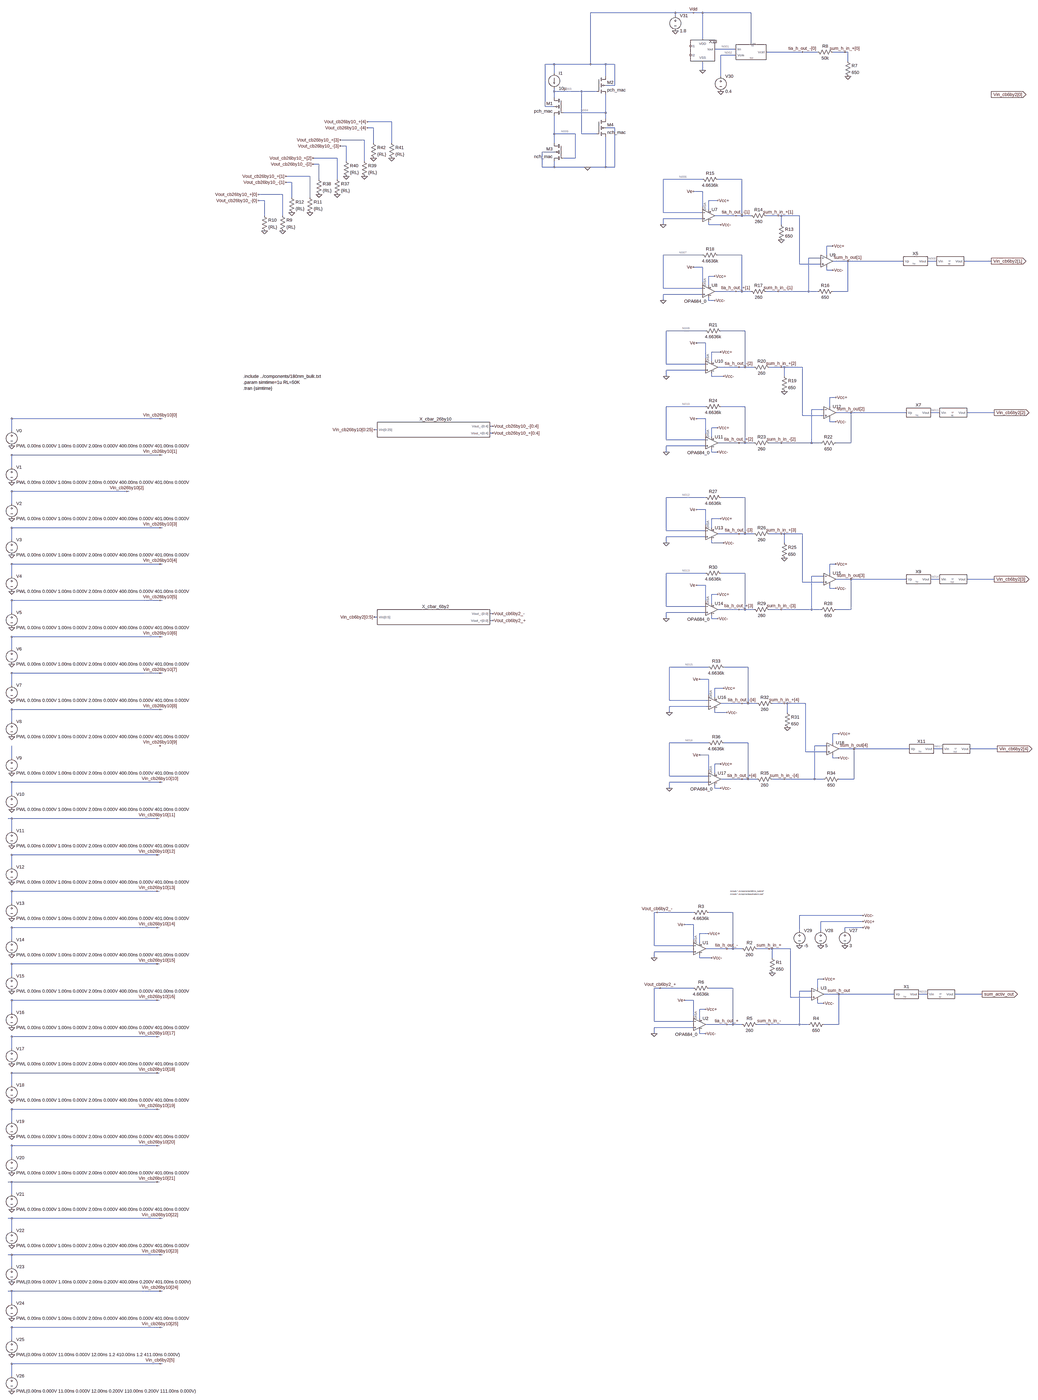
[diagram p0: schematic complete_circuit_generated_2.asc, whole sheet]
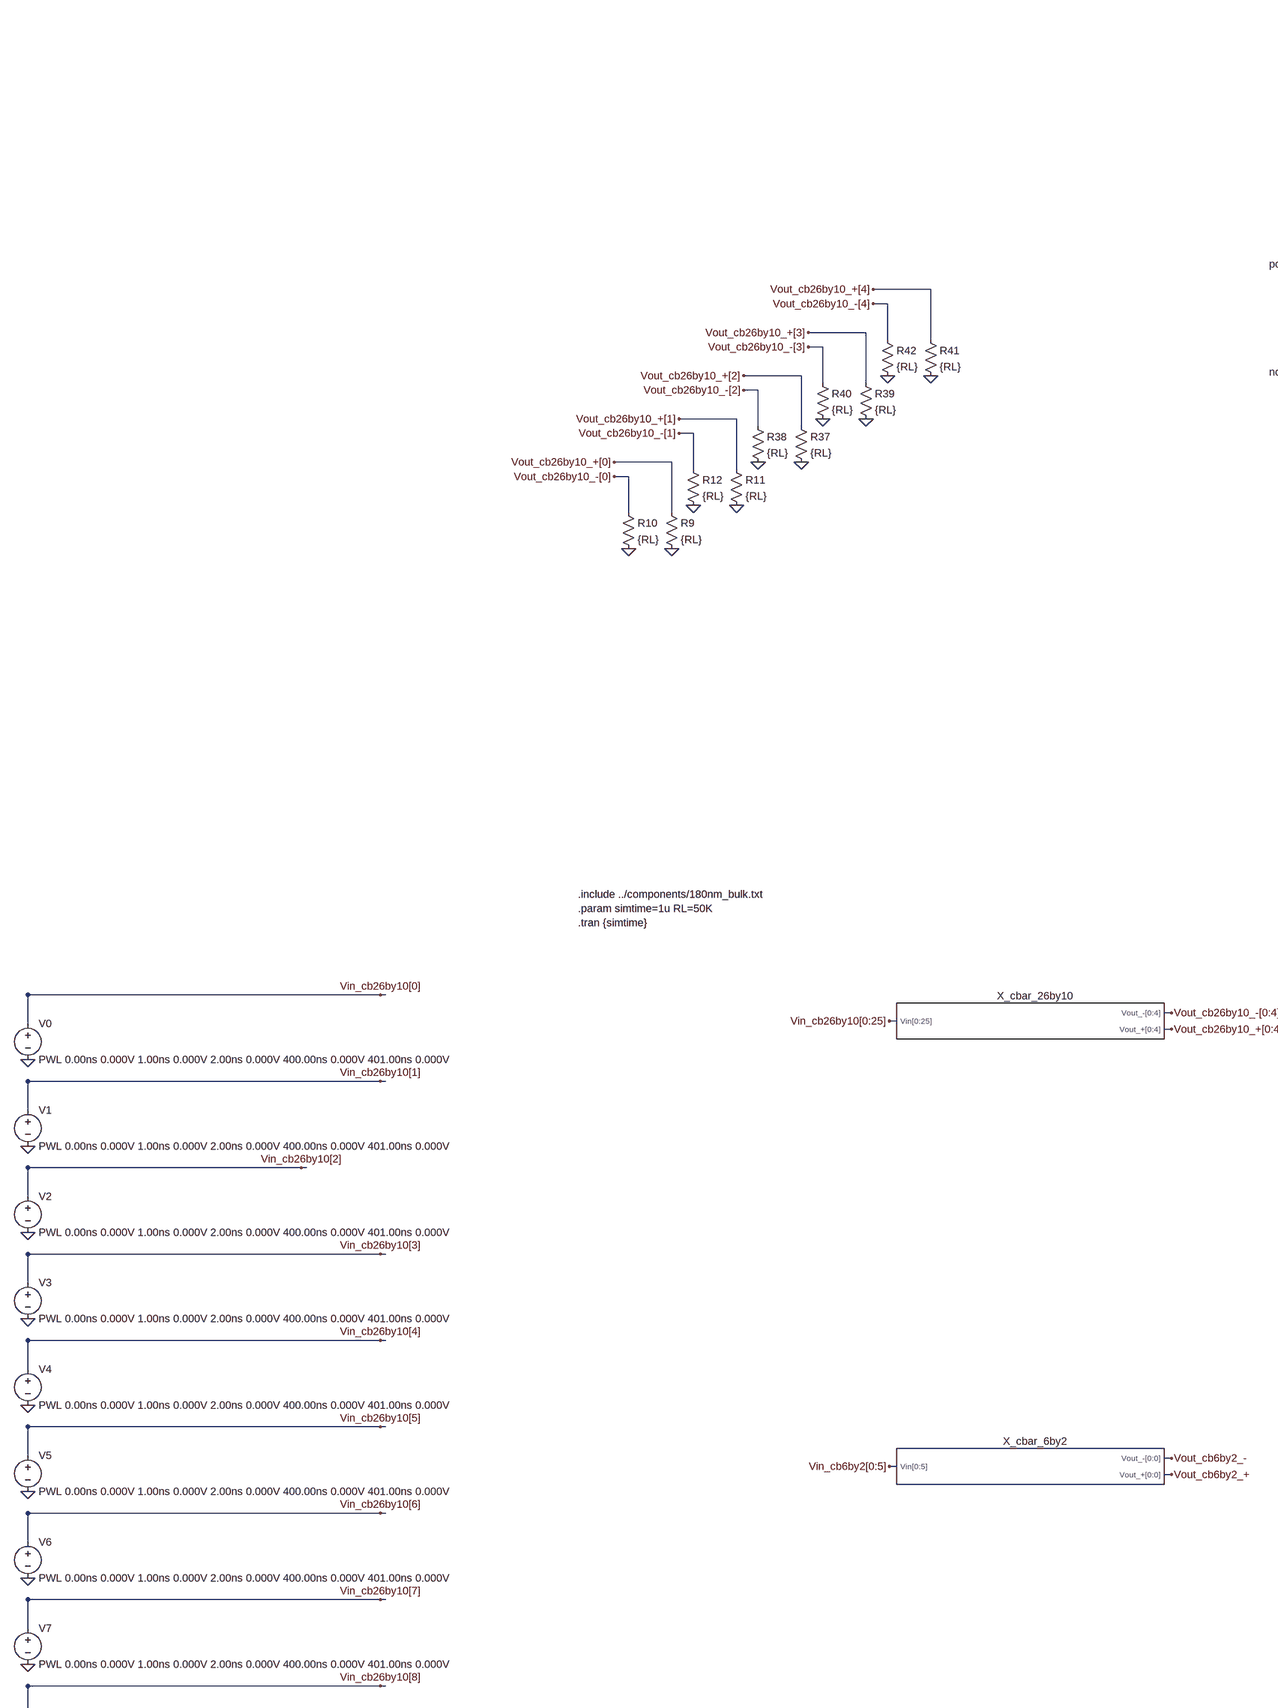
[diagram p1: schematic complete_circuit_generated_2.asc, part, row 1 of 2, column 1 of 2]
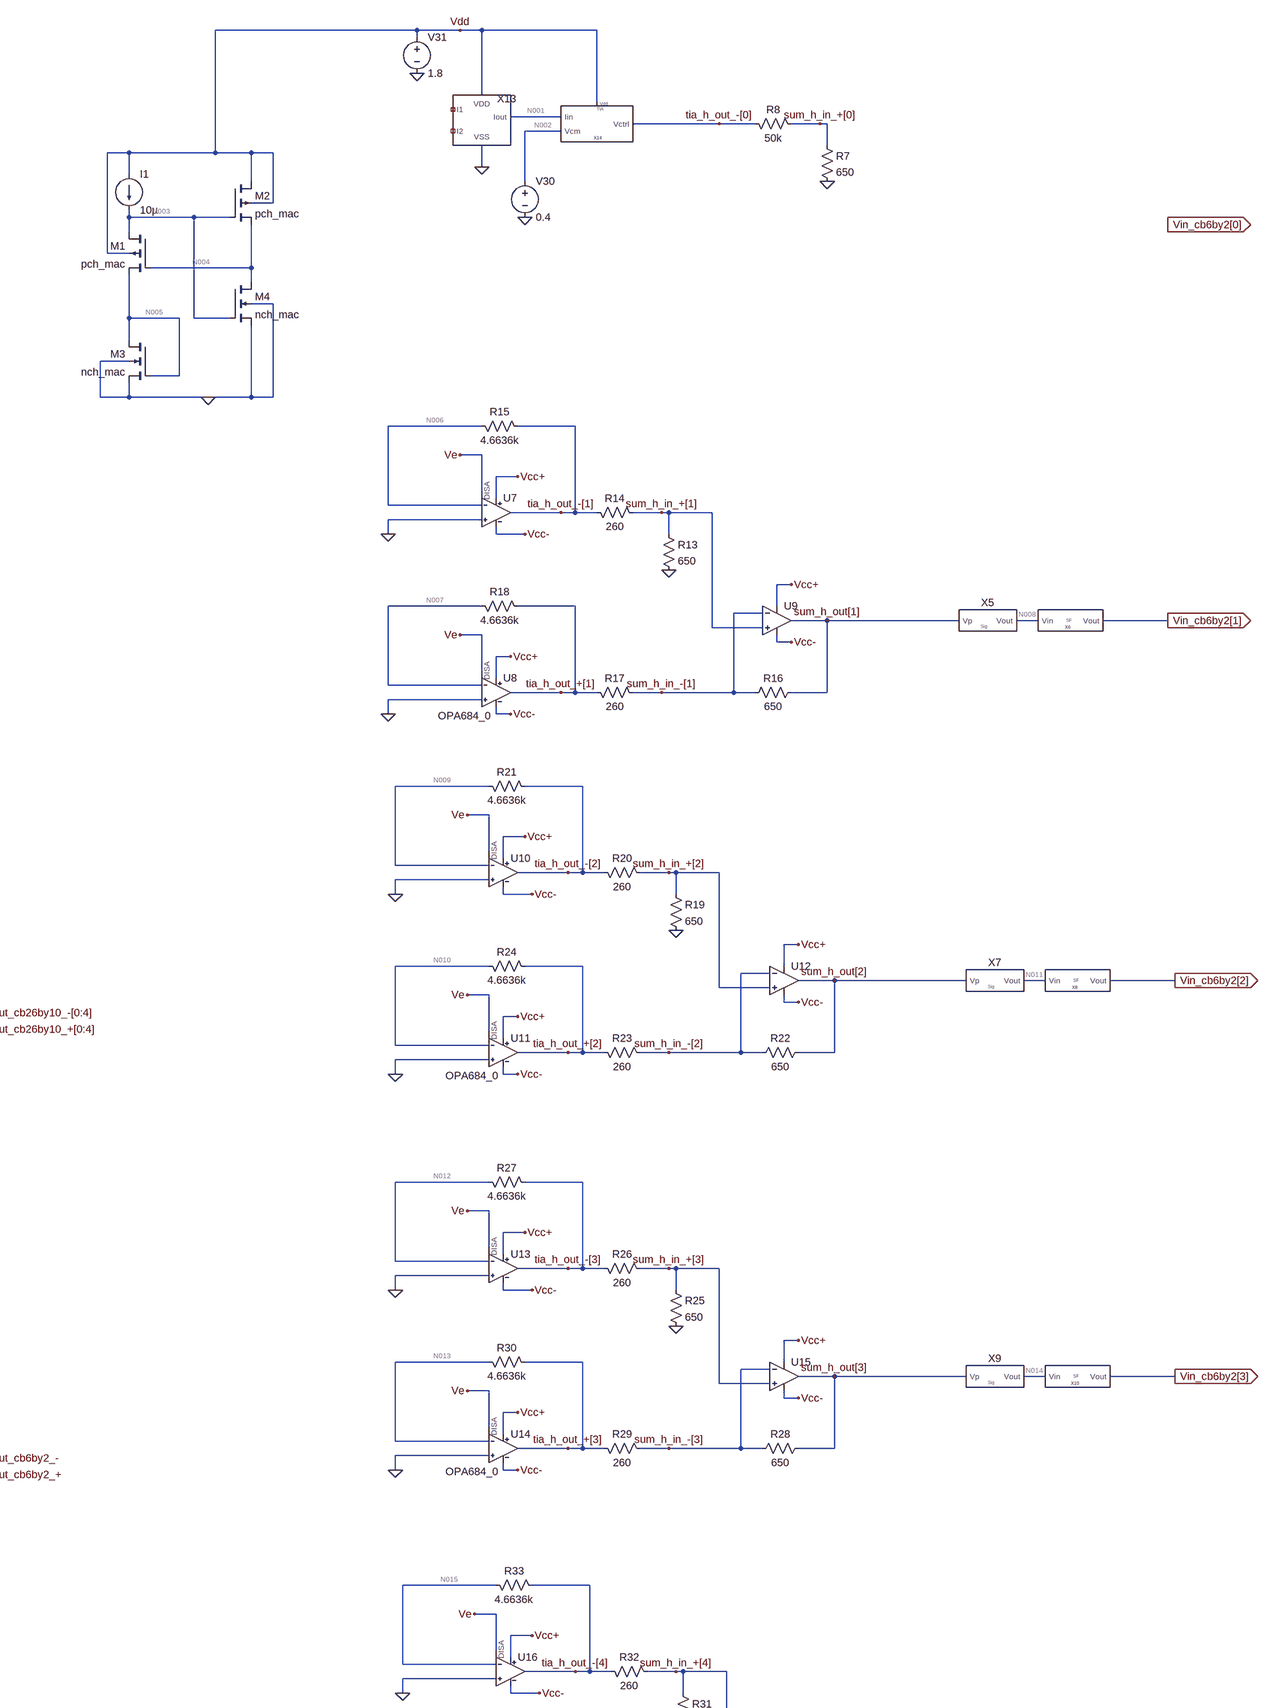
[diagram p2: schematic complete_circuit_generated_2.asc, part, row 1 of 2, column 2 of 2]
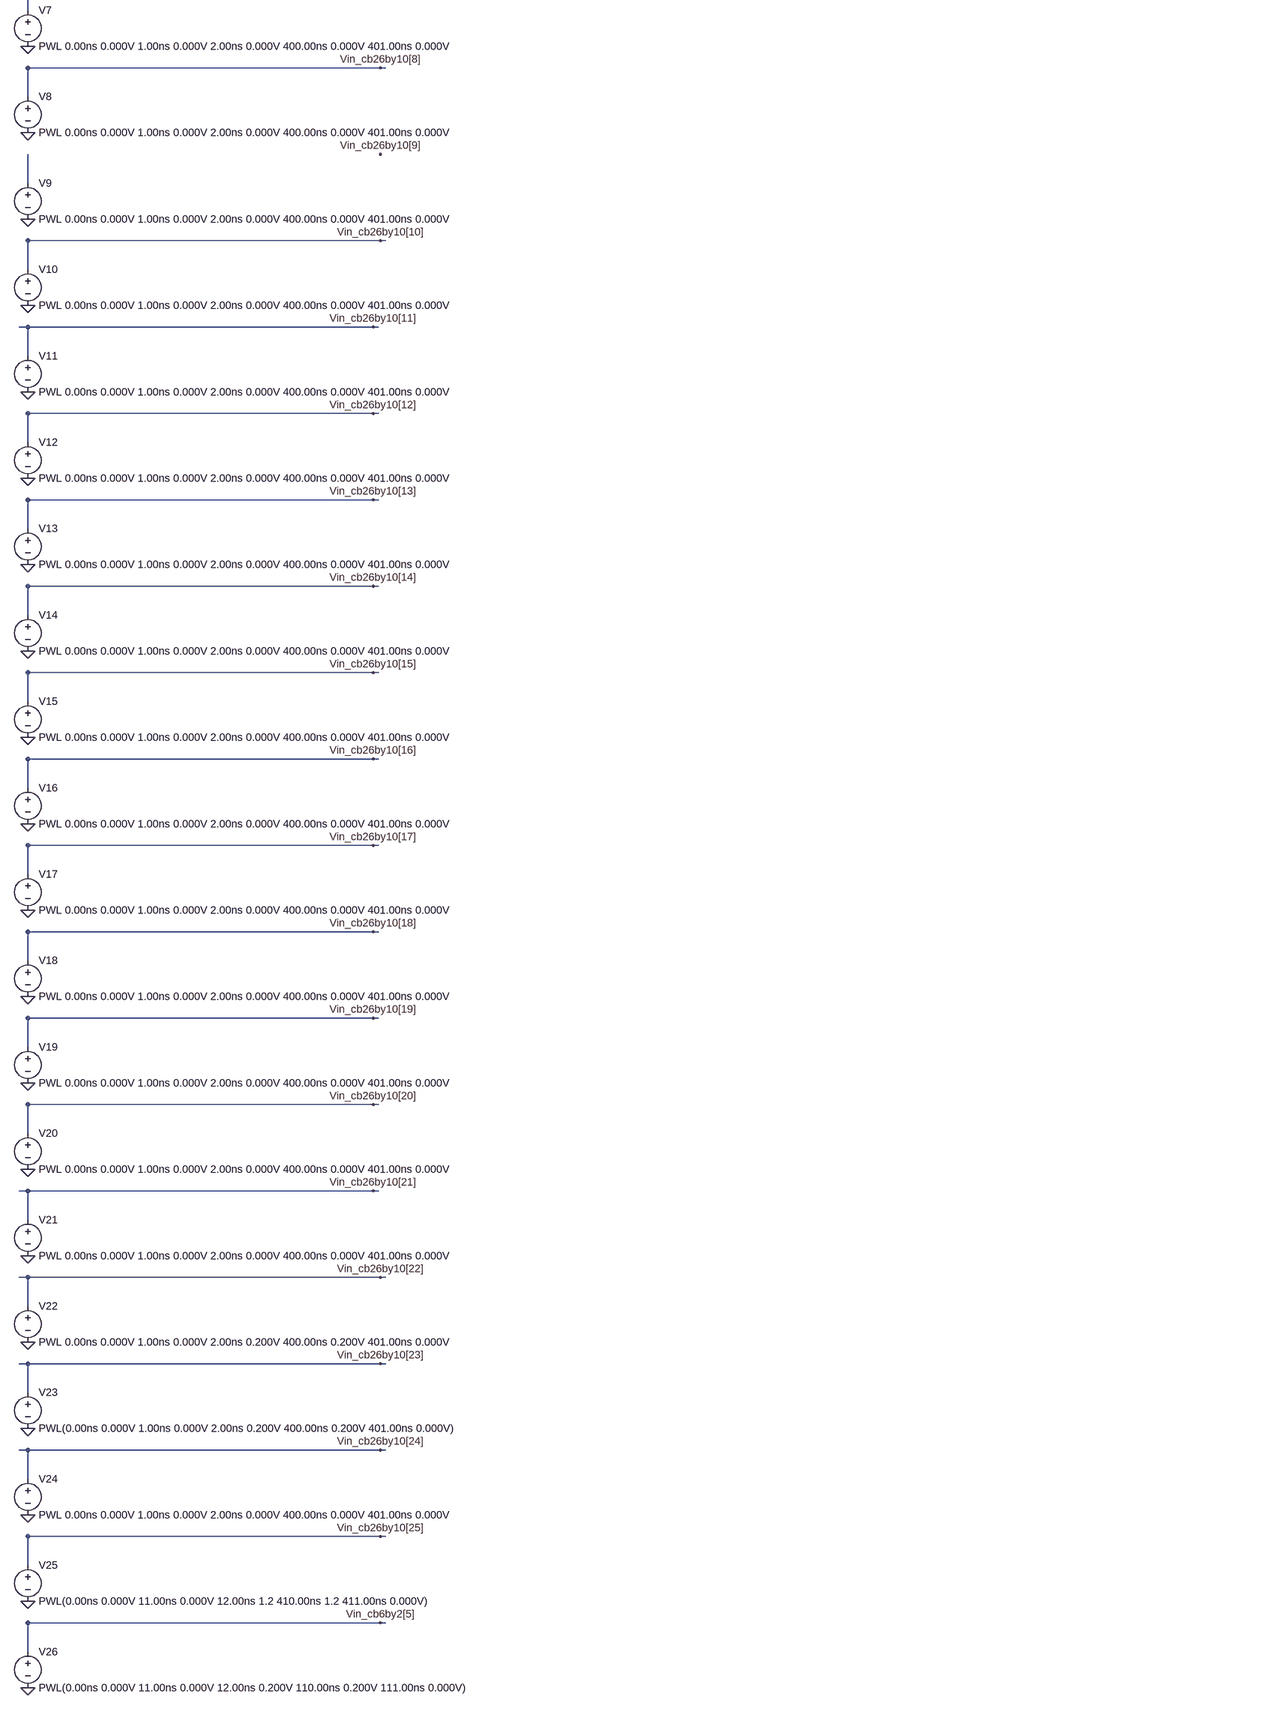
[diagram p3: schematic complete_circuit_generated_2.asc, part, row 2 of 2, column 1 of 2]
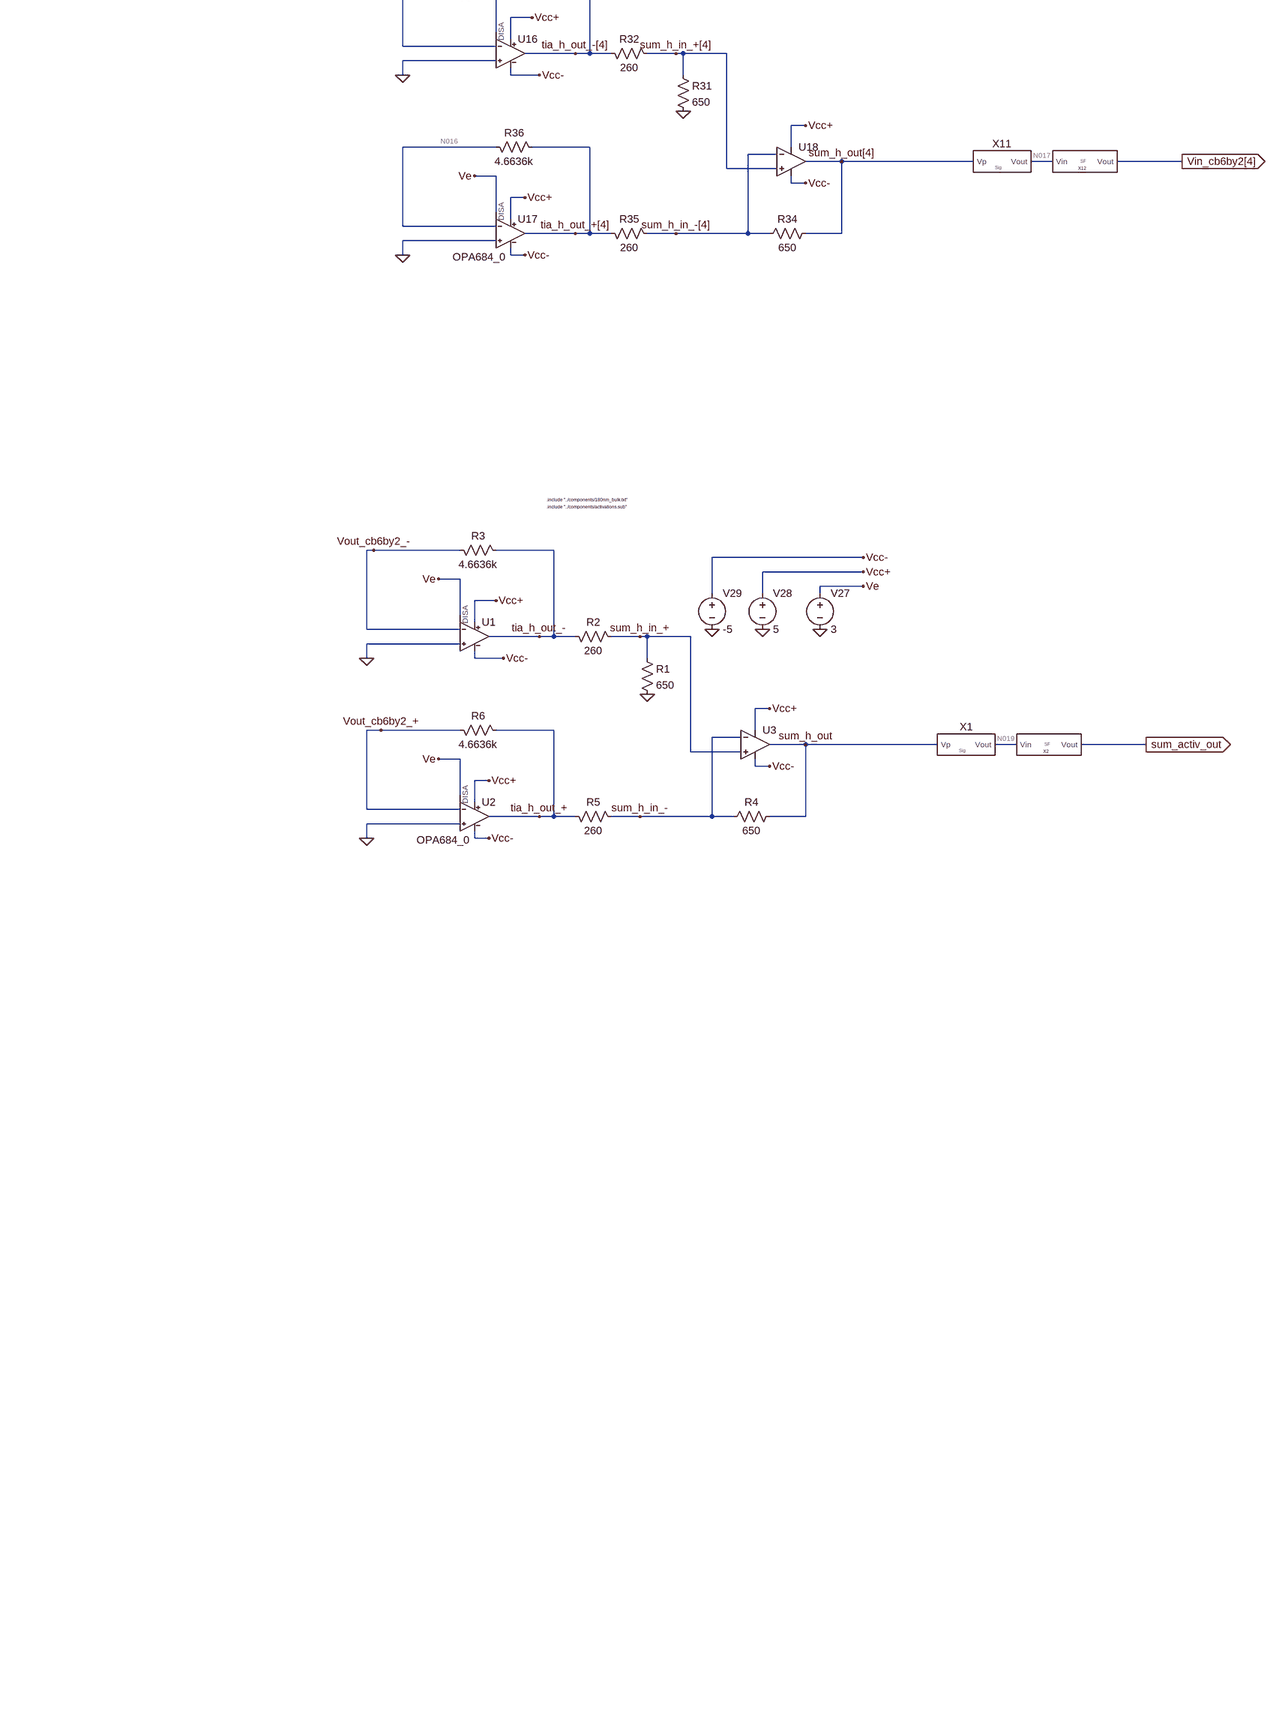
[diagram p4: schematic complete_circuit_generated_2.asc, part, row 2 of 2, column 2 of 2]
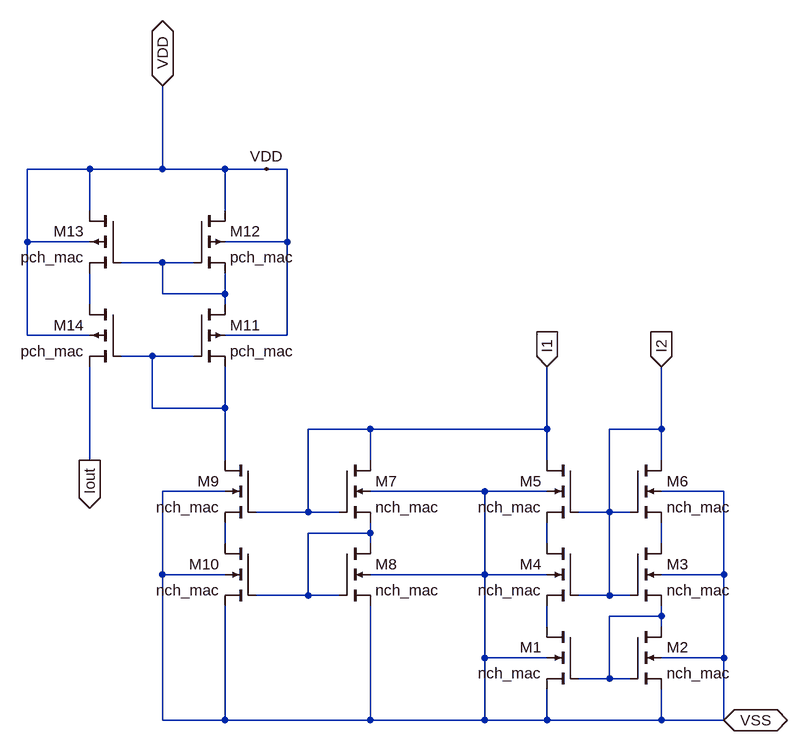
[diagram p5: sub-circuit currentsubtractor.asc]
* complete_circuit_generated_2.asc
XX_cbar_26by10 Vin_cb26by10[0] Vin_cb26by10[1] Vin_cb26by10[2] Vin_cb26by10[3] Vin_cb26by10[4] Vin_cb26by10[5] Vin_cb26by10[6] Vin_cb26by10[7] Vin_cb26by10[8] Vin_cb26by10[9] Vin_cb26by10[10] Vin_cb26by10[11] Vin_cb26by10[12] Vin_cb26by10[13] Vin_cb26by10[14] Vin_cb26by10[15] Vin_cb26by10[16] Vin_cb26by10[17] Vin_cb26by10[18] Vin_cb26by10[19] Vin_cb26by10[20] Vin_cb26by10[21] Vin_cb26by10[22] Vin_cb26by10[23] Vin_cb26by10[24] Vin_cb26by10[25] Vout_cb26by10_+[0] Vout_cb26by10_+[1] Vout_cb26by10_+[2] Vout_cb26by10_+[3] Vout_cb26by10_+[4] Vout_cb26by10_-[0] Vout_cb26by10_-[1] Vout_cb26by10_-[2] Vout_cb26by10_-[3] Vout_cb26by10_-[4] X_cbar_26by10  ; pins Vin[0:25] Vout_+[0:4] Vout_-[0:4]
XX_cbar_6by2 Vin_cb6by2[0] Vin_cb6by2[1] Vin_cb6by2[2] Vin_cb6by2[3] Vin_cb6by2[4] Vin_cb6by2[5] Vout_cb6by2_+ Vout_cb6by2_- X_cbar_6by2  ; pins Vin[0:5] Vout_+[0:0] Vout_-[0:0]
V0 Vin_cb26by10[0] 0 PWL 0.00ns 0.000V 1.00ns 0.000V 2.00ns 0.000V 400.00ns 0.000V 401.00ns 0.000V
V1 Vin_cb26by10[1] 0 PWL 0.00ns 0.000V 1.00ns 0.000V 2.00ns 0.000V 400.00ns 0.000V 401.00ns 0.000V
V2 Vin_cb26by10[2] 0 PWL 0.00ns 0.000V 1.00ns 0.000V 2.00ns 0.000V 400.00ns 0.000V 401.00ns 0.000V
V3 Vin_cb26by10[3] 0 PWL 0.00ns 0.000V 1.00ns 0.000V 2.00ns 0.000V 400.00ns 0.000V 401.00ns 0.000V
V4 Vin_cb26by10[4] 0 PWL 0.00ns 0.000V 1.00ns 0.000V 2.00ns 0.000V 400.00ns 0.000V 401.00ns 0.000V
V5 Vin_cb26by10[5] 0 PWL 0.00ns 0.000V 1.00ns 0.000V 2.00ns 0.000V 400.00ns 0.000V 401.00ns 0.000V
V6 Vin_cb26by10[6] 0 PWL 0.00ns 0.000V 1.00ns 0.000V 2.00ns 0.000V 400.00ns 0.000V 401.00ns 0.000V
V7 Vin_cb26by10[7] 0 PWL 0.00ns 0.000V 1.00ns 0.000V 2.00ns 0.000V 400.00ns 0.000V 401.00ns 0.000V
V8 Vin_cb26by10[8] 0 PWL 0.00ns 0.000V 1.00ns 0.000V 2.00ns 0.000V 400.00ns 0.000V 401.00ns 0.000V
V9 N018 0 PWL 0.00ns 0.000V 1.00ns 0.000V 2.00ns 0.000V 400.00ns 0.000V 401.00ns 0.000V
V10 Vin_cb26by10[10] 0 PWL 0.00ns 0.000V 1.00ns 0.000V 2.00ns 0.000V 400.00ns 0.000V 401.00ns 0.000V
V11 Vin_cb26by10[11] 0 PWL 0.00ns 0.000V 1.00ns 0.000V 2.00ns 0.000V 400.00ns 0.000V 401.00ns 0.000V
V12 Vin_cb26by10[12] 0 PWL 0.00ns 0.000V 1.00ns 0.000V 2.00ns 0.000V 400.00ns 0.000V 401.00ns 0.000V
V13 Vin_cb26by10[13] 0 PWL 0.00ns 0.000V 1.00ns 0.000V 2.00ns 0.000V 400.00ns 0.000V 401.00ns 0.000V
V14 Vin_cb26by10[14] 0 PWL 0.00ns 0.000V 1.00ns 0.000V 2.00ns 0.000V 400.00ns 0.000V 401.00ns 0.000V
V15 Vin_cb26by10[15] 0 PWL 0.00ns 0.000V 1.00ns 0.000V 2.00ns 0.000V 400.00ns 0.000V 401.00ns 0.000V
V16 Vin_cb26by10[16] 0 PWL 0.00ns 0.000V 1.00ns 0.000V 2.00ns 0.000V 400.00ns 0.000V 401.00ns 0.000V
V17 Vin_cb26by10[17] 0 PWL 0.00ns 0.000V 1.00ns 0.000V 2.00ns 0.000V 400.00ns 0.000V 401.00ns 0.000V
V18 Vin_cb26by10[18] 0 PWL 0.00ns 0.000V 1.00ns 0.000V 2.00ns 0.000V 400.00ns 0.000V 401.00ns 0.000V
V19 Vin_cb26by10[19] 0 PWL 0.00ns 0.000V 1.00ns 0.000V 2.00ns 0.000V 400.00ns 0.000V 401.00ns 0.000V
V20 Vin_cb26by10[20] 0 PWL 0.00ns 0.000V 1.00ns 0.000V 2.00ns 0.000V 400.00ns 0.000V 401.00ns 0.000V
V21 Vin_cb26by10[21] 0 PWL 0.00ns 0.000V 1.00ns 0.000V 2.00ns 0.000V 400.00ns 0.000V 401.00ns 0.000V
V22 Vin_cb26by10[22] 0 PWL 0.00ns 0.000V 1.00ns 0.000V 2.00ns 0.200V 400.00ns 0.200V 401.00ns 0.000V
V23 Vin_cb26by10[23] 0 PWL(0.00ns 0.000V 1.00ns 0.000V 2.00ns 0.200V 400.00ns 0.200V 401.00ns 0.000V)
V24 Vin_cb26by10[24] 0 PWL 0.00ns 0.000V 1.00ns 0.000V 2.00ns 0.000V 400.00ns 0.000V 401.00ns 0.000V
V25 Vin_cb26by10[25] 0 PWL(0.00ns 0.000V 11.00ns 0.000V 12.00ns 1.2 410.00ns 1.2 411.00ns 0.000V)
V26 Vin_cb6by2[5] 0 PWL(0.00ns 0.000V 11.00ns 0.000V 12.00ns 0.200V 110.00ns 0.200V 111.00ns 0.000V)
R1 sum_h_in_+ 0 650
R2 sum_h_in_+ tia_h_out_- 260
R3 tia_h_out_- Vout_cb6by2_- 4.6636k
XU1 0 Vout_cb6by2_- Vcc+ Vcc- tia_h_out_- Ve OPA684_0  ; pins In+ In- V+ V- OUT DISA
V27 Ve 0 3
V28 Vcc+ 0 5
V29 Vcc- 0 -5
R4 sum_h_out sum_h_in_- 650
R5 sum_h_in_- tia_h_out_+ 260
R6 tia_h_out_+ Vout_cb6by2_+ 4.6636k
XU2 0 Vout_cb6by2_+ Vcc+ Vcc- tia_h_out_+ Ve OPA684_0  ; pins In+ In- V+ V- OUT DISA
XU3 sum_h_in_+ sum_h_in_- Vcc+ Vcc- sum_h_out MAX4223  ; pins In+ In- V+ V- OUT
XX1 sum_h_out N019 RNN_Sigmoid3_HA  ; pins Vp Vout
XX2 N019 sum_activ_out sourceFollower  ; pins Vin Vout
R7 sum_h_in_+[0] 0 650
R8 sum_h_in_+[0] tia_h_out_-[0] 50k
R13 sum_h_in_+[1] 0 650
R14 sum_h_in_+[1] tia_h_out_-[1] 260
R15 tia_h_out_-[1] N006 4.6636k
XU7 0 N006 Vcc+ Vcc- tia_h_out_-[1] Ve OPA684_0  ; pins In+ In- V+ V- OUT DISA
R16 sum_h_out[1] sum_h_in_-[1] 650
R17 sum_h_in_-[1] tia_h_out_+[1] 260
R18 tia_h_out_+[1] N007 4.6636k
XU8 0 N007 Vcc+ Vcc- tia_h_out_+[1] Ve OPA684_0  ; pins In+ In- V+ V- OUT DISA
XU9 sum_h_in_+[1] sum_h_in_-[1] Vcc+ Vcc- sum_h_out[1] MAX4223  ; pins In+ In- V+ V- OUT
XX5 sum_h_out[1] N008 RNN_Sigmoid3_HA  ; pins Vp Vout
XX6 N008 Vin_cb6by2[1] sourceFollower  ; pins Vin Vout
R19 sum_h_in_+[2] 0 650
R20 sum_h_in_+[2] tia_h_out_-[2] 260
R21 tia_h_out_-[2] N009 4.6636k
XU10 0 N009 Vcc+ Vcc- tia_h_out_-[2] Ve OPA684_0  ; pins In+ In- V+ V- OUT DISA
R22 sum_h_out[2] sum_h_in_-[2] 650
R23 sum_h_in_-[2] tia_h_out_+[2] 260
R24 tia_h_out_+[2] N010 4.6636k
XU11 0 N010 Vcc+ Vcc- tia_h_out_+[2] Ve OPA684_0  ; pins In+ In- V+ V- OUT DISA
XU12 sum_h_in_+[2] sum_h_in_-[2] Vcc+ Vcc- sum_h_out[2] MAX4223  ; pins In+ In- V+ V- OUT
XX7 sum_h_out[2] N011 RNN_Sigmoid3_HA  ; pins Vp Vout
XX8 N011 Vin_cb6by2[2] sourceFollower  ; pins Vin Vout
R25 sum_h_in_+[3] 0 650
R26 sum_h_in_+[3] tia_h_out_-[3] 260
R27 tia_h_out_-[3] N012 4.6636k
XU13 0 N012 Vcc+ Vcc- tia_h_out_-[3] Ve OPA684_0  ; pins In+ In- V+ V- OUT DISA
R28 sum_h_out[3] sum_h_in_-[3] 650
R29 sum_h_in_-[3] tia_h_out_+[3] 260
R30 tia_h_out_+[3] N013 4.6636k
XU14 0 N013 Vcc+ Vcc- tia_h_out_+[3] Ve OPA684_0  ; pins In+ In- V+ V- OUT DISA
XU15 sum_h_in_+[3] sum_h_in_-[3] Vcc+ Vcc- sum_h_out[3] MAX4223  ; pins In+ In- V+ V- OUT
XX9 sum_h_out[3] N014 RNN_Sigmoid3_HA  ; pins Vp Vout
XX10 N014 Vin_cb6by2[3] sourceFollower  ; pins Vin Vout
R31 sum_h_in_+[4] 0 650
R32 sum_h_in_+[4] tia_h_out_-[4] 260
R33 tia_h_out_-[4] N015 4.6636k
XU16 0 N015 Vcc+ Vcc- tia_h_out_-[4] Ve OPA684_0  ; pins In+ In- V+ V- OUT DISA
R34 sum_h_out[4] sum_h_in_-[4] 650
R35 sum_h_in_-[4] tia_h_out_+[4] 260
R36 tia_h_out_+[4] N016 4.6636k
XU17 0 N016 Vcc+ Vcc- tia_h_out_+[4] Ve OPA684_0  ; pins In+ In- V+ V- OUT DISA
XU18 sum_h_in_+[4] sum_h_in_-[4] Vcc+ Vcc- sum_h_out[4] MAX4223  ; pins In+ In- V+ V- OUT
XX11 sum_h_out[4] N017 RNN_Sigmoid3_HA  ; pins Vp Vout
XX12 N017 Vin_cb6by2[4] sourceFollower  ; pins Vin Vout
V31 Vdd 0 1.8
XX13 NC_01 NC_02 N001 Vdd 0 currentsubtractor
XX14 N001 N002 tia_h_out_-[0] Vdd tia_sch_v0  ; pins Iin Vcm Vctrl Vdd
V30 N002 0 0.4
R9 Vout_cb26by10_+[0] 0 {RL}
M1 N003 N004 N005 Vdd pch_mac l=180n w=36u m=100
M2 Vdd N003 N004 Vdd pch_mac l=180n w=10.8u
M3 N005 N005 0 0 nch_mac l=0.18u w=3.6u m=100
I1 Vdd N003 10µ
M4 N004 N003 0 0 nch_mac l=0.18u w=0.18u
R10 Vout_cb26by10_-[0] 0 {RL}
R11 Vout_cb26by10_+[1] 0 {RL}
R12 Vout_cb26by10_-[1] 0 {RL}
R37 Vout_cb26by10_+[2] 0 {RL}
R38 Vout_cb26by10_-[2] 0 {RL}
R39 Vout_cb26by10_+[3] 0 {RL}
R40 Vout_cb26by10_-[3] 0 {RL}
R41 Vout_cb26by10_+[4] 0 {RL}
R42 Vout_cb26by10_-[4] 0 {RL}

* block symbol definitions
.subckt currentsubtractor I1 I2 Iout VDD VSS
M1 N009 N008 VSS VSS nch_mac l=180n w=5u
M2 N008 N008 VSS VSS nch_mac l=180n w=5u
M3 N007 I2 N008 VSS nch_mac l=180n w=5u m=2
M4 N006 I2 N009 VSS nch_mac l=180n w=5u m=2
M5 I1 I2 N006 VSS nch_mac l=180n w=5u
M6 I2 I2 N007 VSS nch_mac l=180n w=5u
M7 I1 I1 N004 VSS nch_mac l=180n w=5u
M8 N004 N004 VSS VSS nch_mac l=180n w=5u
M9 N003 I1 N005 VSS nch_mac l=180n w=5u
M10 N005 N004 VSS VSS nch_mac l=180n w=5u
M11 N001 N003 N003 VDD pch_mac l=180n w=1u
M12 VDD N001 N001 VDD pch_mac l=180n w=1u
M13 VDD N001 N002 VDD pch_mac l=180n w=1u
M14 N002 N003 Iout VDD pch_mac l=180n w=1u
.ends currentsubtractor

.model NMOS NMOS
.model PMOS PMOS
.lib standard.mos
.tran {simtime}
.param simtime=1u RL=50K
.include ../components/180nm_bulk.txt
.include "../components/activations.sub"
.include "../components/180nm_bulk.txt"
.backanno
.end

* Results of the author's LTspice run, read from the files saved beside the schematic
* Operating Point, zero values left out:
*   V(vin_cb6by2[0]) = -426.7 µV
*   V(vout_cb6by2_+) = -426.8 µV
*   V(vout_cb6by2_-) = -426.7 µV
*   V(vin_cb6by2[1]) = 11.15 mV
*   V(vin_cb6by2[2]) = 11.15 mV
*   V(vin_cb6by2[3]) = 11.15 mV
*   V(vin_cb6by2[4]) = 11.15 mV
*   V(sum_h_in_+) = -9.061 mV
*   V(tia_h_out_-) = -11.78 mV
*   V(ve) = 3 V
*   V(vcc-) = -5 V
*   V(vcc+) = 5 V
*   V(sum_h_out) = -33.75 mV
*   V(sum_h_in_-) = -9.037 mV
*   V(tia_h_out_+) = -58 µV
*   V(n019) = 8.133 mV
*   V(sum_activ_out) = 8.133 mV
*   V(sum_h_in_+[0]) = 5.133 mV
*   V(tia_h_out_-[0]) = 400 mV
*   V(sum_h_in_+[1]) = 11.81 mV
*   V(tia_h_out_-[1]) = 17.45 mV
*   V(n006) = -426.9 µV
*   V(sum_h_out[1]) = -4.658 mV
*   V(sum_h_in_-[1]) = 11.78 mV
*   V(tia_h_out_+[1]) = 17.45 mV
*   V(n007) = -426.9 µV
*   V(n008) = 11.15 mV
*   V(sum_h_in_+[2]) = 11.81 mV
*   V(tia_h_out_-[2]) = 17.45 mV
*   V(n009) = -426.9 µV
*   V(sum_h_out[2]) = -4.658 mV
*   V(sum_h_in_-[2]) = 11.78 mV
*   V(tia_h_out_+[2]) = 17.45 mV
*   V(n010) = -426.9 µV
*   V(n011) = 11.15 mV
*   V(sum_h_in_+[3]) = 11.81 mV
*   V(tia_h_out_-[3]) = 17.45 mV
*   V(n012) = -426.9 µV
*   V(sum_h_out[3]) = -4.658 mV
*   V(sum_h_in_-[3]) = 11.78 mV
*   V(tia_h_out_+[3]) = 17.45 mV
*   V(n013) = -426.9 µV
*   V(n014) = 11.15 mV
*   V(sum_h_in_+[4]) = 11.81 mV
*   V(tia_h_out_-[4]) = 17.45 mV
*   V(n015) = -426.9 µV
*   V(sum_h_out[4]) = -4.658 mV
*   V(sum_h_in_-[4]) = 11.78 mV
*   V(tia_h_out_+[4]) = 17.45 mV
*   V(n016) = -426.9 µV
*   V(n017) = 11.15 mV
*   V(vdd) = 1.8 V
*   V(n001) = 400 mV
*   V(n002) = 400 mV
*   V(n003) = 1.358 V
*   V(n004) = 1.254 V
*   V(n005) = 222.6 mV
*   Id(M3) = 10 µA
*   Ib(M3) = -23.26 pA
*   Is(M3) = -10 µA
*   Id(M4) = 82.84 µA
*   Ib(M4) = -1.264 pA
*   Is(M4) = -82.84 µA
*   Id(M1) = 10 µA
*   Ib(M1) = 204 pA
*   Is(M1) = -10 µA
*   Id(M2) = 82.84 µA
*   Is(M2) = -82.84 µA
*   I(I1) = 10 µA
*   I(R1) = -13.94 µA
*   I(R2) = 10.44 µA
*   I(R3) = -2.434 µA
*   I(R4) = -38.02 µA
*   I(R5) = -34.53 µA
*   I(R6) = 79.08 nA
*   I(R7) = 7.897 µA
*   I(R8) = -7.897 µA
*   I(R13) = 18.17 µA
*   I(R14) = -21.67 µA
*   I(R15) = 3.832 µA
*   I(R16) = -25.29 µA
*   I(R17) = -21.79 µA
*   I(R18) = 3.832 µA
*   I(R19) = 18.17 µA
*   I(R20) = -21.67 µA
*   I(R21) = 3.832 µA
*   I(R22) = -25.29 µA
*   I(R23) = -21.79 µA
*   I(R24) = 3.832 µA
*   I(R25) = 18.17 µA
*   I(R26) = -21.67 µA
*   I(R27) = 3.832 µA
*   I(R28) = -25.29 µA
*   I(R29) = -21.79 µA
*   I(R30) = 3.832 µA
*   I(R31) = 18.17 µA
*   I(R32) = -21.67 µA
*   I(R33) = 3.832 µA
*   I(R34) = -25.29 µA
*   I(R35) = -21.79 µA
*   I(R36) = 3.832 µA
*   I(V26) = -76.47 nA
*   I(V27) = -28.03 nA
*   I(V28) = -31.92 mA
*   I(V29) = 21.89 mA
*   I(V31) = -92.85 µA
*   I(V30) = 2 nA
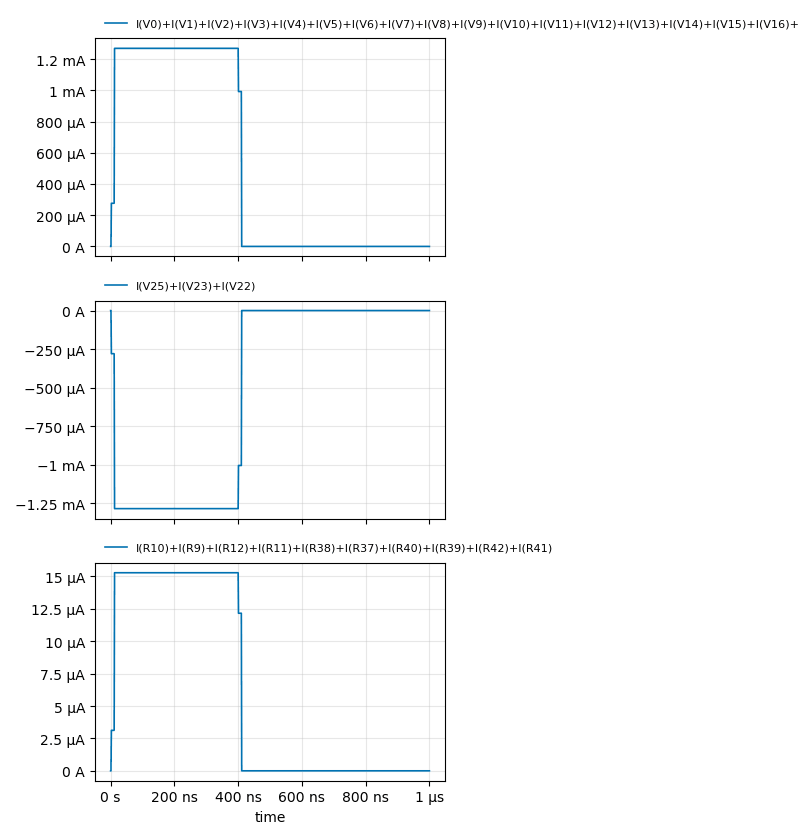
[diagram p6: Transient Analysis of complete_circuit_generated_2.asc, plotted from the saved traces]
* Transient Analysis, 1 run:
*   I(V0)+I(V1)+I(V2)+I(V3)+I(V4)+I(V5)+I(V6)+I(V7)+I(V8)+I(V9)+I(V10)+I(V11)+I(V12)+I(V13)+I(V14)+I(V15)+I(V16)+I(V17)+I(V18)+I(V19)+I(V20)+I(V21)+I(V24): min 0 A, max 1.269 mA, average 506.2 µA, rms 797.8 µA, last 0 A
*   I(V25)+I(V23)+I(V22): min -1.284 mA, max 0 A, average -512.3 µA, rms 807.4 µA, last 0 A
*   I(R10)+I(R9)+I(R12)+I(R11)+I(R38)+I(R37)+I(R40)+I(R39)+I(R42)+I(R41): min 0 A, max 15.28 µA, average 6.098 µA, rms 9.612 µA, last 0 A